# Altium schematic sheet Accel Circuit - Eddie.SchDoc
size Letter
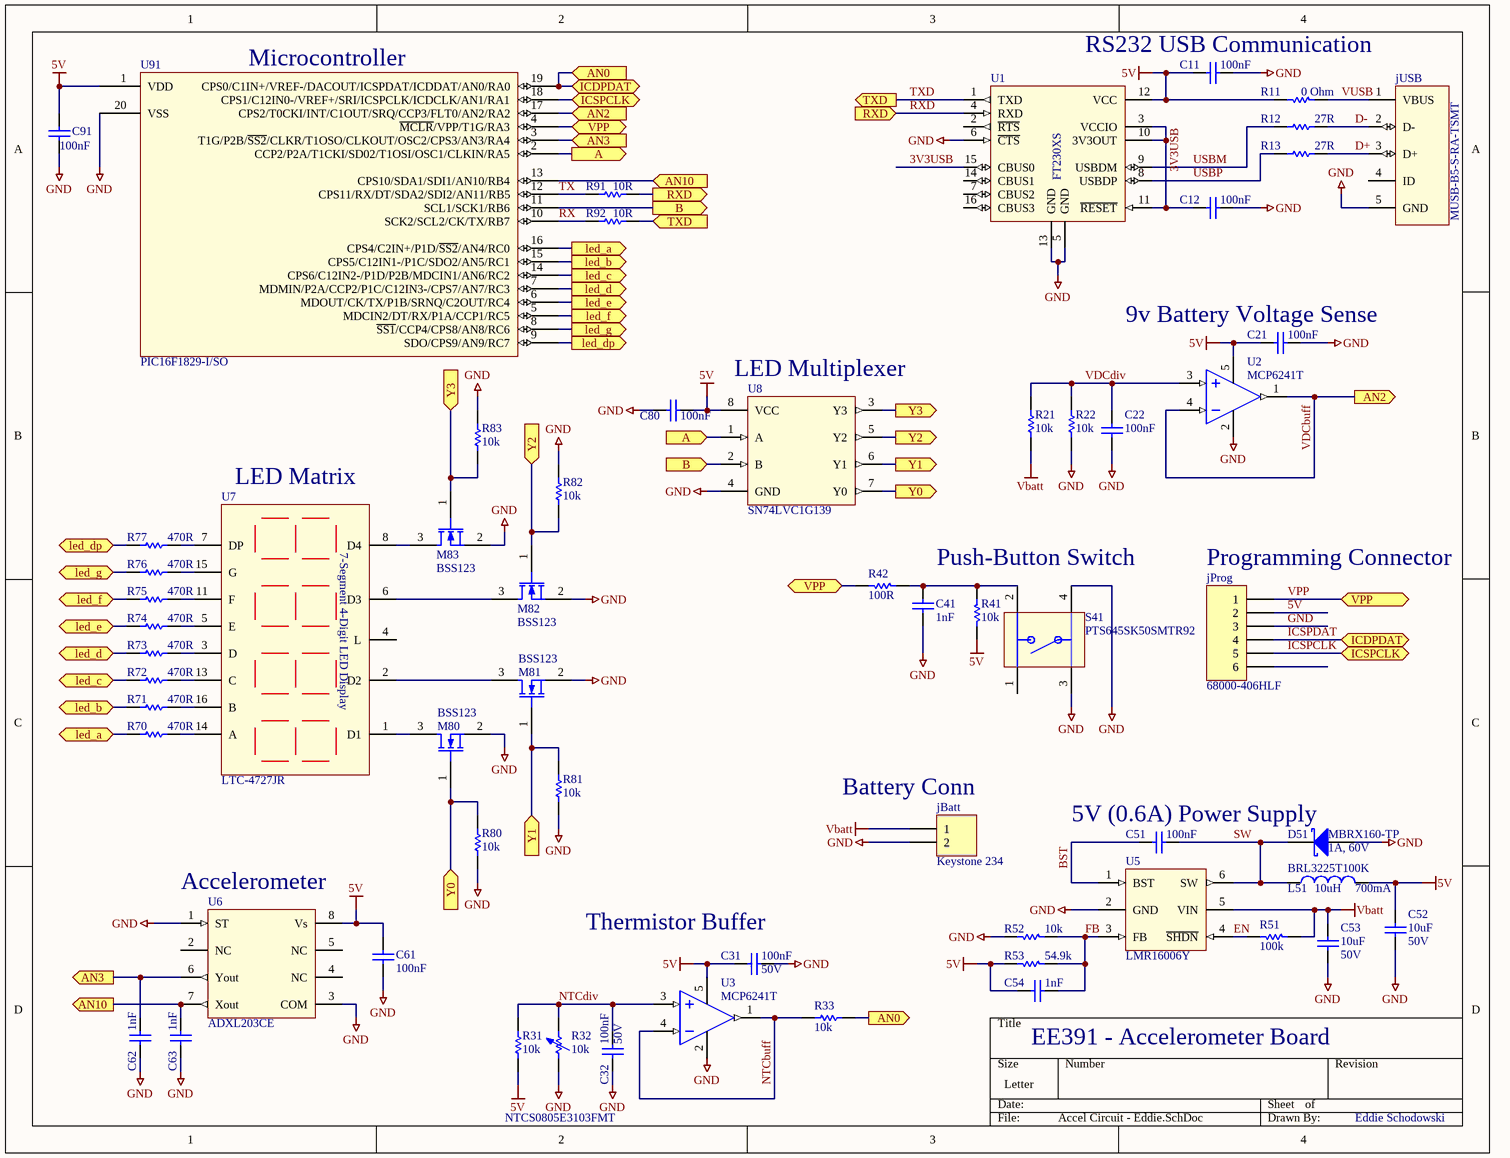
[diagram p0: Accel Circuit - Eddie.SchDoc]

## Parts
C11  value 100nF  [CAPC2012N]  (hidden comment: C0805C104K5VACTU)
C12  value 100nF  [CAPC2012N]  (hidden comment: C0805C104K5VACTU)
C21  value 100nF  [CAPC2012N]  (hidden comment: C0805C104K5VACTU)
C22  value 100nF  [CAPC2012N]  (hidden comment: C0805C104K5VACTU)
C31  value 100nF  Rated: 50V  [CAPC2012N]  (hidden comment: C0805C104K5VACTU)
C32  value 100nF  Rated: 50V  [CAPC2012N]  (hidden comment: C0805C104K5VACTU)
C41  value 1nF  [CAPC2012N]  (hidden comment: C0805C102K5RACTU)
C51  value 100nF  [CAPC2012N]  (hidden comment: C0805C104K5VACTU)
C52  value 10uF  Rated: 50V  [CAPC3216N]  (hidden comment: C3216X5R1H106M)
C53  value 10uF  Rated: 50V  [CAPC3216N]  (hidden comment: C3216X5R1H106M)
C54  value 1nF  [CAPC2012N]  (hidden comment: C0805C102K5RACTU)
C61  value 100nF  [CAPC2012N]  (hidden comment: C0805C104K5VACTU)
C62  value 1nF  [CAPC2012N]  (hidden comment: C0805C102K5RACTU)
C63  value 1nF  [CAPC2012N]  (hidden comment: C0805C102K5RACTU)
C80  value 100nF  [CAPC2012N]  (hidden comment: C0805C104K5VACTU)
C91  value 100nF  [CAPC2012N]  (hidden comment: C0805C104K5VACTU)
D51  MBRX160-TP  Rated: 1A, 60V  [SOD123]
jBatt  Keystone 234  [HDR1X2]
jProg  68000-406HLF  [HDR1X6]
jUSB  MUSB-B5-S-RA-TSMT  [MUSB-B5-S-RA-TSMT]
L51  BRL3225T100K  value 10uH  Rated: 700mA  [INDC3225N]
M80  BSS123  [SOT23-3N]
M81  BSS123  [SOT23-3N]
M82  BSS123  [SOT23-3N]
M83  BSS123  [SOT23-3N]
R11  value 0 Ohm  [RESC2012N]  (hidden comment: ERJ-6GEY0R00V)
R12  value 27R  [RESC2012N]  (hidden comment: ERJ-6ENF27R0V)
R13  value 27R  [RESC2012N]  (hidden comment: ERJ-6ENF27R0V)
R21  value 10k  [RESC2012N]  (hidden comment: ERJ-6ENF1002V)
R22  value 10k  [RESC2012N]  (hidden comment: ERJ-6ENF1002V)
R31  value 10k  [RESC2012N]  (hidden comment: ERJ-6ENF1002V)
R32  NTCS0805E3103FMT  value 10k  [RESC2012N]
R33  value 10k  [RESC2012N]  (hidden comment: ERJ-6ENF1002V)
R41  value 10k  [RESC2012N]  (hidden comment: ERJ-6ENF1002V)
R42  value 100R  [RESC2012N]  (hidden comment: ERJ-6ENF1000V)
R51  value 100k  [RESC2012N]  (hidden comment: ERJ-6ENF1003V)
R52  value 10k  [RESC2012N]  (hidden comment: ERJ-6ENF1002V)
R53  value 54.9k  [RESC2012N]  (hidden comment: ERJ-6ENF5492V)
R70  value 470R  [RESC2012N]  (hidden comment: ERJ-6ENF4700V)
R71  value 470R  [RESC2012N]  (hidden comment: ERJ-6ENF4700V)
R72  value 470R  [RESC2012N]  (hidden comment: ERJ-6ENF4700V)
R73  value 470R  [RESC2012N]  (hidden comment: ERJ-6ENF4700V)
R74  value 470R  [RESC2012N]  (hidden comment: ERJ-6ENF4700V)
R75  value 470R  [RESC2012N]  (hidden comment: ERJ-6ENF4700V)
R76  value 470R  [RESC2012N]  (hidden comment: ERJ-6ENF4700V)
R77  value 470R  [RESC2012N]  (hidden comment: ERJ-6ENF4700V)
R80  value 10k  [RESC2012N]  (hidden comment: ERJ-6ENF1002V)
R81  value 10k  [RESC2012N]  (hidden comment: ERJ-6ENF1002V)
R82  value 10k  [RESC2012N]  (hidden comment: ERJ-6ENF1002V)
R83  value 10k  [RESC2012N]  (hidden comment: ERJ-6ENF1002V)
R91  value 10R  [RESC2012N]  (hidden comment: ERJ-6ENF10R0V)
R92  value 10R  [RESC2012N]  (hidden comment: ERJ-6ENF10R0V)
S41  PTS645SK50SMTR92  [PTS645 Series]
U1  FT230XS  [TSSOP-16]
U2  MCP6241T  [SOT23-5N]
U3  MCP6241T  [SOT23-5N]
U5  LMR16006Y  [SOT23-6N]
U6  ADXL203CE
U7  LTC-4727JR  [LTC Series]
U8  SN74LVC1G139  [TSSOP-8]
U91  PIC16F1829-I/SO  [SOIC-20-300]

## Ports
A (in), A (out), AN0 (in), AN0 (out), AN2 (in), AN2 (out), AN3 (in), AN3 (out), AN10 (in), AN10 (out), B (in), B (out), ICDPDAT, ICSPCLK, led_a, led_a (out), led_b, led_b (out), led_c, led_c (out), led_d, led_d (out), led_dp, led_dp (out), led_e, led_e (out), led_f, led_f (out), led_g, led_g (out), RXD (in), RXD (out), TXD (in), TXD (out), VPP, Y0 (in), Y0 (out), Y1 (in), Y1 (out), Y2 (in), Y2 (out), Y3 (in), Y3 (out)

## Nets
5V: C11.1 C21.2 C31.1 C52.1 C54.1 C61.2 C80.1 C91.2 jProg.2 L51.2 R11.1 R31.2 R41.1 R53.2 U1.12(VCC) U2.5(VDD) U3.5(VDD) U6.8(Vs) U8.8(VCC) U91.1(VDD)
GND: C11.2 C12.2 C21.1 C22.1 C31.2 C32.2 C41.1 C52.2 C53.2 C61.1 C62.1 C63.1 C80.2 C91.1 D51.1(A) jBatt.2 jProg.3 jUSB.0(TAB) jUSB.5(GND) M80.2(S) M81.2(S) M82.2(S) M83.2(S) R22.2 R32.1 R52.2 R80.1 R81.1 R82.2 R83.2 S41.3(+) S41.4(+) U1.5(GND) U1.6(~{CTS}) U1.13(GND) U2.2(VSS) U3.2(VSS) U5.2(GND) U6.1(ST) U6.3(COM) U8.4(GND) U91.20(VSS)
Vbatt: C53.1 jBatt.1 R21.1 R51.1 U5.5(VIN)
3V3USB: C12.1 U1.3(VCCIO) U1.10(3V3OUT) U1.11(~{RESET}) U1.15(CBUS0)
A: U8.1(A) U91.2(CCP2/P2A/T1CKI/SD02/T1OSI/OSC1/CLKIN/RA5) ; port A
AN3: C62.2 U6.6(Yout) U91.3(T1G/P2B/~{SS2}/CLKR/T1OSO/CLKOUT/OSC2/CPS3/AN3/RA4) ; port AN3
AN10: C63.2 U6.7(Xout) U91.13(CPS10/SDA1/SDI1/AN10/RB4) ; port AN10
B: U8.2(B) U91.11(SCL1/SCK1/RB6) ; port B
BST: C51.2 U5.1(BST)
D+: jUSB.3(D+) R13.2
D-: jUSB.2(D-) R12.2
EN: R51.2 U5.4(~{SHDN})
FB: C54.2 R52.1 R53.1 U5.3(FB)
ICSPCLK: jProg.5 U91.18(CPS1/C12IN0-/VREF+/SRI/ICSPCLK/ICDCLK/AN1/RA1) ; port ICSPCLK
ICSPDAT: jProg.4 R33.2 U91.19(CPS0/C1IN+/VREF-/DACOUT/ICSPDAT/ICDDAT/AN0/RA0) ; port AN0, port ICDPDAT
led_a: R70.1 U91.16(CPS4/C2IN+/P1D/~{SS2}/AN4/RC0) ; port led_a
led_b: R71.1 U91.15(CPS5/C12IN1-/P1C/SDO2/AN5/RC1) ; port led_b
led_c: R72.1 U91.14(CPS6/C12IN2-/P1D/P2B/MDCIN1/AN6/RC2) ; port led_c
led_d: R73.1 U91.7(MDMIN/P2A/CCP2/P1C/C12IN3-/CPS7/AN7/RC3) ; port led_d
led_dp: R77.1 U91.9(SDO/CPS9/AN9/RC7) ; port led_dp
led_e: R74.1 U91.6(MDOUT/CK/TX/P1B/SRNQ/C2OUT/RC4) ; port led_e
led_f: R75.1 U91.5(MDCIN2/DT/RX/P1A/CCP1/RC5) ; port led_f
led_g: R76.1 U91.8(~{SS1}/CCP4/CPS8/AN8/RC6) ; port led_g
NTCbuff: R33.1 U3.1(OUT) U3.4(IN-)
NTCdiv: C32.1 R31.1 R32.2 U3.3(IN+)
RX: R92.1 U91.10(SCK2/SCL2/CK/TX/RB7)
RXD: R91.2 U1.4(RXD) ; port RXD
SW: C51.1 D51.2(K) L51.1 U5.6(SW)
TX: R91.1 U91.12(CPS11/RX/DT/SDA2/SDI2/AN11/RB5)
TXD: R92.2 U1.1(TXD) ; port TXD
USBM: R12.1 U1.9(USBDM)
USBP: R13.1 U1.8(USBDP)
VDCbuff: U2.1(OUT) U2.4(IN-) U91.17(CPS2/T0CKI/INT/C1OUT/SRQ/CCP3/FLT0/AN2/RA2) ; port AN2
VDCdiv: C22.2 R21.2 R22.1 U2.3(IN+)
VPP: jProg.1 R42.1 U91.4(~{MCLR}/VPP/T1G/RA3) ; port VPP
VUSB: jUSB.1(VBUS) R11.2
Y0: M80.1(G) R80.2 U8.7(Y0) ; port Y0
Y1: M81.1(G) R81.2 U8.6(Y1) ; port Y1
Y2: M82.1(G) R82.1 U8.5(Y2) ; port Y2
Y3: M83.1(G) R83.1 U8.3(Y3) ; port Y3
NetC41_2: C41.2 R41.2 R42.2 S41.2(+)
NetM80_3: M80.3(D) U7.1(D1)
NetM81_3: M81.3(D) U7.2(D2)
NetM82_3: M82.3(D) U7.6(D3)
NetM83_3: M83.3(D) U7.8(D4)
NetR70_2: R70.2 U7.14(A)
NetR71_2: R71.2 U7.16(B)
NetR72_2: R72.2 U7.13(C)
NetR73_2: R73.2 U7.3(D)
NetR74_2: R74.2 U7.5(E)
NetR75_2: R75.2 U7.11(F)
NetR76_2: R76.2 U7.15(G)
NetR77_2: R77.2 U7.7(DP)

Not connected (* = marked no-connect by the designer): jProg 6; jUSB 4(ID); S41 1(+); U1 2(~{RTS}) 7(CBUS2) 14(CBUS1) 16(CBUS3); U6 2(NC) 4(NC) 5(NC); U7 4(L)

## Notes on the sheet
- (near U91) Microcontroller
- (near C11) RS232 USB Communication
- (near C21) 9v Battery Voltage Sense
- (near U8) LED Multiplexer
- LED Matrix
- Push-Button Switch
- (near jProg) Programming Connector
- (near jBatt) Battery Conn
- 5V (0.6A) Power Supply
- (near U6) Accelerometer
- (near C31) Thermistor Buffer
- (near C54) EE391 - Accelerometer Board
- Eddie Schodowski
- (in symbol LTC-4727JR) 7-Segment 4-Digit LED Display

## Library data of the parts
C11 C12 C21 C22 C51 C61 C80 C91 = Cap: Capacitor; Rated: 50V; Tol: 20%; Temp: 125C; Supplier 1: Digi-Key; Supplier Part Number 1: 399-1170-1-ND; Category: C
C31 C32 = Cap: Capacitor; Tol: 20%; Temp: 125C; Supplier 1: Digi-Key; Supplier Part Number 1: 399-1170-1-ND; Category: C
C41 C54 C62 C63 = Cap: Capacitor; Rated: 50V; Tol: 10%; Temp: 85C; Supplier 1: Digi-Key; Supplier Part Number 1: 399-1147-1-ND; Category: C
C52 C53 = Cap: Capacitor; Tol: 20%; Temp: 85C; Supplier 1: Digi-Key; Supplier Part Number 1: 445-5999-1-ND; Category: C
D51 = D Schottky: Schottky Diode; Value: 720mV @ 1A; Category: D; Supplier 1: Digi-Key; Supplier Part Number 1: MBRX160TPMSCT-ND
jBatt = Header 2: 9V Battery Connector, 8" Free Hanging, 2-Pin; Category: J; Supplier 1: Digi-Key; Supplier Part Number 1: 36-234-ND
jProg = Header 6: Header, 6-Pin; Category: J; Supplier 1: Digi-Key; Supplier Part Number 1: 609-3263-ND
jUSB = USB Mini-B Conn: Mini-USB Type-B Connector, Surface Mount; ComponentLink1Description: &Datasheet; ComponentLink1URL: http://www.farnell.com/datasheets/1359588.pdf; Category: J; Supplier 1: Newark; Supplier Part Number 1: 71Y7363
L51 = BLM21P221SN: Ferrite Bead Inductor; Supplier 1: Digi-Key; Supplier Part Number 1: 587-2167-1-ND; Category: L
M80-M83 = BSS123: Low-Power N-Channel MOSFET, 100V 170mA; Rated: 170mA, 100V; Value: 6 Ohm; Supplier 1: Digi-Key; Supplier Part Number 1: BSS123NCT-ND; Category: M
R11 = Res1: Resistor; Rated: 1/8W; Supplier 1: Digi-Key; Supplier Part Number 1: P0.0ACT-ND; Category: R
R12 R13 R21 R22 R31 R33 R41 R42 R51-R53 R70-R77 R80-R83 R91 R92 = Res1: Resistor; Rated: 1/8W; Tol: 1%; Supplier 1: Digi-Key; Category: R
  R12 R13: Supplier Part Number 1: P27.0CCT-ND
  R21 R22 R31 R33 R41 R52 R80-R83: Supplier Part Number 1: P10.0KCCT-ND
  R42: Supplier Part Number 1: P100CCT-ND
  R51: Supplier Part Number 1: P100KCCT-ND
  R53: Supplier Part Number 1: P54.9KCCT-ND
  R70-R77: Supplier Part Number 1: P470CCT-ND
  R91 R92: Supplier Part Number 1: P10.0CCT-ND
R32 = NTCS0805E3103FMT: NTC Thermistor Resistor, 10kOhm; Temp: 150C; Tol: 1%; Rated: 3570K; Category: R; Supplier 1: Digi-Key; Supplier Part Number 1: BC2558CT-ND
S41 = PTS645SK50SMTR92: Tactile Switch, SPST-NO, Top-Actuated; Rated: 50mA, 12V; Temp: 60C; Category: H; Supplier 1: Digi-Key; Supplier Part Number 1: CKN9087CT-ND
U1 = FT230XS: USB to Basic UART Converter; Rated: USB 2.0; Supplier 1: Digi-Key; Supplier Part Number 1: 768-1135-1-ND; ComponentLink1Description: &Datasheet; ComponentLink1URL: http://www.ftdichip.com/Support/Documents/DataSheets/ICs/DS_FT230X.pdf; Category: U
U2 = MCP6241T: Low-Power Operational Amplifier; Rated: 1.8V~5.5V; Category: U; ComponentLink1Description: &Datasheet; ComponentLink1URL: http://ww1.microchip.com/downloads/en/DeviceDoc/21882d.pdf; Supplier 1: Digi-Key; Supplier Part Number 1: MCP6241T-E/OTCT-ND
U3 = MCP6241: Low-Power Operational Amplifier; Rated: 1.8V~5.5V; Temp: 125C; Supplier 1: Digi-Key; Supplier Part Number 1: MCP6241T-E/OTCT-ND; ComponentLink1Description: &Datasheet; ComponentLink1URL: http://ww1.microchip.com/downloads/en/DeviceDoc/21882d.pdf; Category: U
U5 = LMR16006X: Step-down 2.1MHz Switching Regulator; Rated: 600mA, 60V; Value: 2.1MHz, 900mOhm; Temp: 125C; Category: U; Supplier 1: Digi-Key; Supplier Part Number 1: 296-38547-1-ND
U6 = ADXL203CE: Dual-Axis SMT Accelerometer; Rated: 3V ~ 6V; Temp: 125C; Value: +/- 1.7g; Supplier 1: Digi-Key; Supplier Part Number 1: ADXL203CE-ND; Category: U
U7 = LTC-4727JR: LED 7-Segment Display, 4-Digit, Common-Cathode; Rated: 0.65mcd, 2V; Value: Red; Category: D; Supplier 1: Digi-Key; Supplier Part Number 1: 160-1547-5-ND
U8 = SN74LVC1G139: Decoder / Demultiplexer, 2-to-4 Line; Rated: +/- 24mA, 5.5V; Temp: 85C; Category: U; Supplier 1: Digi-Key; Supplier Part Number 1: 296-18203-1-ND
U91 = PIC16F1829-I/SO: 8-Bit FLASH Microcontroller, 20-Pin SOIC; Rated: 1.8V ~ 5.5V; Temp: 85C; Value: 32MHz; Category: U; Supplier 1: Digi-Key; Supplier Part Number 1: PIC16F1829-I/SO-ND